# EasyEDA Pro project 8-Bit Breadboard Computer Schematics.eprj

# Schematic A-Regsiter
Create Date: 2025-08-08; Page Name: A-Regsiter; Project Name: 8-Bit Breadboard Computer Schematics; Schematic Name: A-Regsiter; Update Date: 2025-12-03; Company: EasyEDA.com; Page Size: A4; Version: V1.0
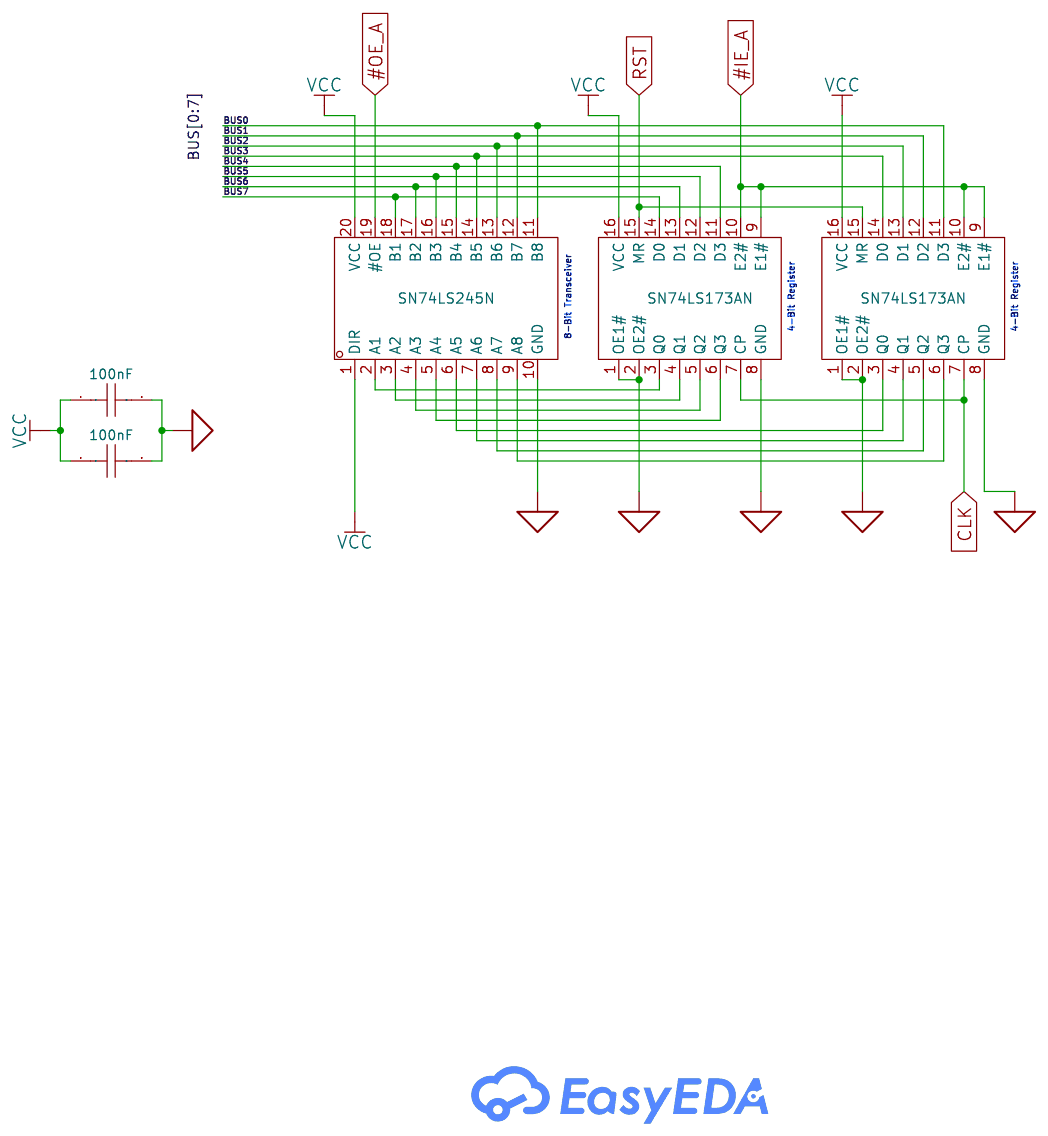
[diagram p0: schematic sheet]

## Parts
100nF  100nF Capacitor  [C0603]
100nF#2  100nF Capacitor  [C0603]
SN74LS173AN  74LS173 (4-Bit Register)  [PDIP-16_L19.3-W6.4-P2.54-LS7.94-BL]
SN74LS173AN#2  74LS173 (4-Bit Register)  [PDIP-16_L19.3-W6.4-P2.54-LS7.94-BL]
SN74LS245N  74LS245 (8-Bit Transceiver)  [DIP-20_L25.5-W10.0-P2.54-LS7.6-BL]

## Library data of the parts
100nF 100nF#2 = C0603C103K5RACTU KEMET Ceramic Capacitor: Supplier Part: C28056281; Supplier Footprint: 0603; Supplier: LCSC
SN74LS173AN = SN74LS173N(LX): LCSC Part Name: SN74LS173N; Supplier Part: C22466320; Manufacturer: LX(灵星芯微); Supplier Footprint: DIP-16; JLCPCB Part Class: Extended Part; Datasheet: https://atta.szlcsc.com/upload/public/pdf/source/20240614/F3FD9DFBB4BF77D77E15C2CBAE389656.pdf; Supplier: LCSC; Type: D-Type; Trigger Type: Rising Edge; Voltage - Supply: 2V~6V; Clock Frequency: 35MHz; Function: Reset; Number of Elements: 1; Number of Bits per Element: 4; Propagation Delay: 30ns@6V,50pF; Series: 74LS Series; Quiescent Current: 8uA; Operating Temperature: -40℃~+125℃
SN74LS173AN#2 = SN74LS173N(LX): LCSC Part Name: SN74LS173N; Supplier Part: C22466320; Manufacturer: LX(灵星芯微); Manufacturer Part: SN74LS173AN; Supplier Footprint: DIP-16; JLCPCB Part Class: Extended Part; Datasheet: https://atta.szlcsc.com/upload/public/pdf/source/20240614/F3FD9DFBB4BF77D77E15C2CBAE389656.pdf; Supplier: LCSC; Type: D-Type; Trigger Type: Rising Edge; Voltage - Supply: 2V~6V; Clock Frequency: 35MHz; Function: Reset; Number of Elements: 1; Number of Bits per Element: 4; Propagation Delay: 30ns@6V,50pF; Series: 74LS Series; Quiescent Current: 8uA; Operating Temperature: -40℃~+125℃
SN74LS245N = SN74LS245N: Supplier Part: C352966; Manufacturer: TI(德州仪器); Supplier Footprint: DIP-20; JLCPCB Part Class: Extended Part; Datasheet: https://www.ti.com/cn/lit/gpn/sn74ls245; Supplier: LCSC; output type: Tri-State; Voltage - Supply: 4.75V~5.25V; Number of Elements: 1; Number of Bits per Element: 8; Current - Output Low(IOL): 24mA; Current - Output High(IOH): 15mA; Logic Family: 74LS; Operating Temperature: 0℃~+70℃

## Nets
GND: 100nF.2 100nF#2.2 SN74LS173AN.1(OE1#) SN74LS173AN.2(OE2#) SN74LS173AN.8(GND) SN74LS173AN#2.1(OE1#) SN74LS173AN#2.2(OE2#) SN74LS173AN#2.8(GND) SN74LS245N.10(GND)
VCC: 100nF.1 100nF#2.1 SN74LS173AN.16(VCC) SN74LS173AN#2.16(VCC) SN74LS245N.1(DIR) SN74LS245N.20(VCC)
#IE_A: SN74LS173AN.9(E1#) SN74LS173AN.10(E2#) SN74LS173AN#2.9(E1#) SN74LS173AN#2.10(E2#)
#OE_A: SN74LS245N.19(#OE)
BUS0: SN74LS173AN#2.11(D3) SN74LS245N.11(B8)
BUS1: SN74LS173AN#2.12(D2) SN74LS245N.12(B7)
BUS2: SN74LS173AN#2.13(D1) SN74LS245N.13(B6)
BUS3: SN74LS173AN#2.14(D0) SN74LS245N.14(B5)
BUS4: SN74LS173AN.11(D3) SN74LS245N.15(B4)
BUS5: SN74LS173AN.12(D2) SN74LS245N.16(B3)
BUS6: SN74LS173AN.13(D1) SN74LS245N.17(B2)
BUS7: SN74LS173AN.14(D0) SN74LS245N.18(B1)
CLK: SN74LS173AN.7(CP) SN74LS173AN#2.7(CP)
RST: SN74LS173AN.15(MR) SN74LS173AN#2.15(MR)
Net-(SN74LS173AN#2-3): SN74LS173AN#2.3(Q0) SN74LS245N.6(A5)
Net-(SN74LS173AN#2-4): SN74LS173AN#2.4(Q1) SN74LS245N.7(A6)
Net-(SN74LS173AN#2-5): SN74LS173AN#2.5(Q2) SN74LS245N.8(A7)
Net-(SN74LS173AN#2-6): SN74LS173AN#2.6(Q3) SN74LS245N.9(A8)
Net-(SN74LS173AN-3): SN74LS173AN.3(Q0) SN74LS245N.2(A1)
Net-(SN74LS173AN-4): SN74LS173AN.4(Q1) SN74LS245N.3(A2)
Net-(SN74LS173AN-5): SN74LS173AN.5(Q2) SN74LS245N.4(A3)
Net-(SN74LS173AN-6): SN74LS173AN.6(Q3) SN74LS245N.5(A4)

## Notes on the sheet
- 8-Bit Transceiver
- 4-Bit Register
- 4-Bit Register

# Schematic B-Regsiter
Create Date: 2025-08-20; Page Name: B-Regsiter; Project Name: 8-Bit Breadboard Computer Schematics; Schematic Name: B-Regsiter; Update Date: 2025-12-23; Company: EasyEDA.com; Page Size: A4; Version: V1.0
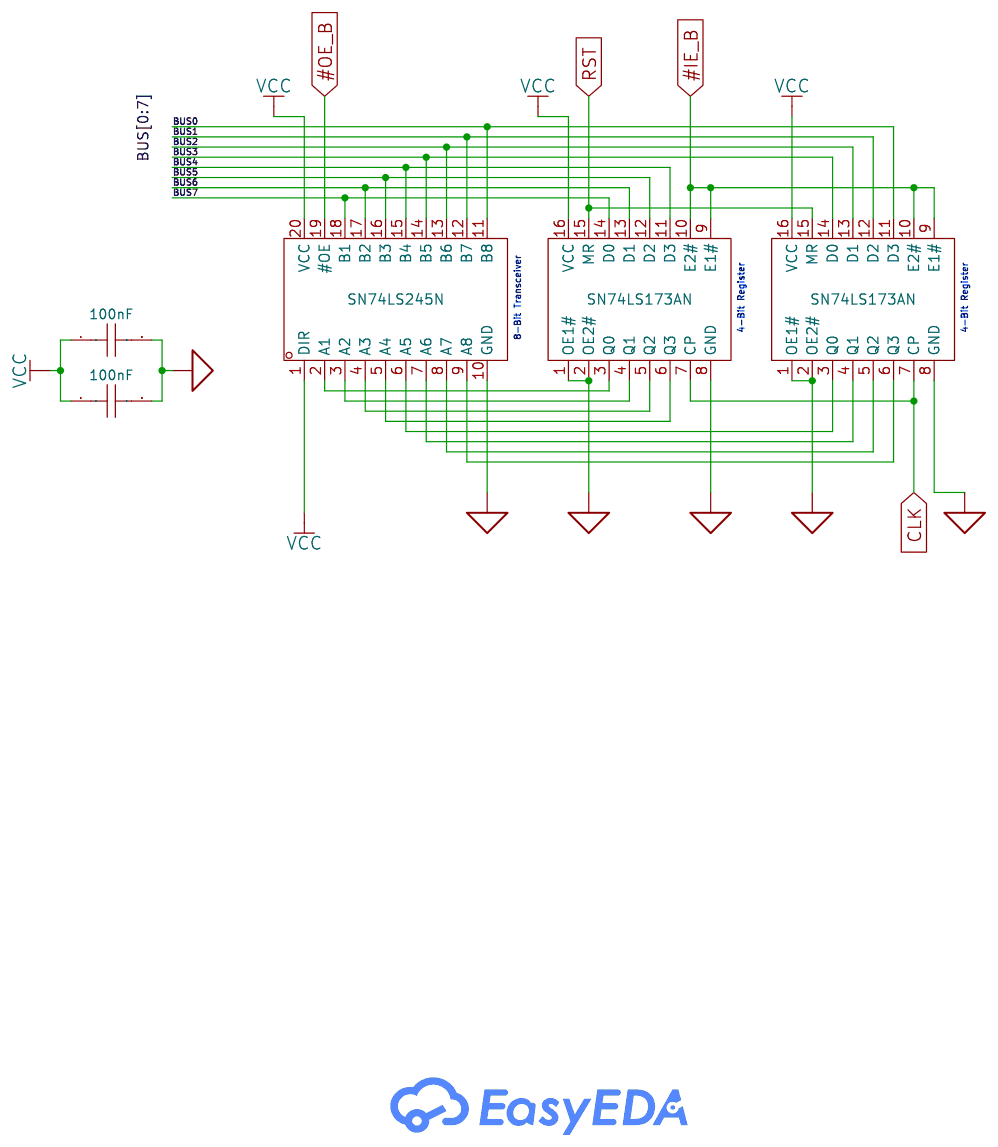
[diagram p1: schematic sheet]

## Parts
100nF  100nF Capacitor  [C0603]
100nF#2  100nF Capacitor  [C0603]
SN74LS173AN  74LS173 (4-Bit Register)  [PDIP-16_L19.3-W6.4-P2.54-LS7.94-BL]
SN74LS173AN#2  74LS173 (4-Bit Register)  [PDIP-16_L19.3-W6.4-P2.54-LS7.94-BL]
SN74LS245N  74LS245 (8-Bit Transceiver)  [DIP-20_L25.5-W10.0-P2.54-LS7.6-BL]

## Library data of the parts
100nF 100nF#2 = C0603C103K5RACTU KEMET Ceramic Capacitor: Supplier Part: C28056281; Supplier Footprint: 0603; Supplier: LCSC
SN74LS173AN = SN74LS173N(LX): LCSC Part Name: SN74LS173N; Supplier Part: C22466320; Manufacturer: LX(灵星芯微); Supplier Footprint: DIP-16; JLCPCB Part Class: Extended Part; Datasheet: https://atta.szlcsc.com/upload/public/pdf/source/20240614/F3FD9DFBB4BF77D77E15C2CBAE389656.pdf; Supplier: LCSC; Type: D-Type; Trigger Type: Rising Edge; Voltage - Supply: 2V~6V; Clock Frequency: 35MHz; Function: Reset; Number of Elements: 1; Number of Bits per Element: 4; Propagation Delay: 30ns@6V,50pF; Series: 74LS Series; Quiescent Current: 8uA; Operating Temperature: -40℃~+125℃
SN74LS173AN#2 = SN74LS173N(LX): LCSC Part Name: SN74LS173N; Supplier Part: C22466320; Manufacturer: LX(灵星芯微); Manufacturer Part: SN74LS173AN; Supplier Footprint: DIP-16; JLCPCB Part Class: Extended Part; Datasheet: https://atta.szlcsc.com/upload/public/pdf/source/20240614/F3FD9DFBB4BF77D77E15C2CBAE389656.pdf; Supplier: LCSC; Type: D-Type; Trigger Type: Rising Edge; Voltage - Supply: 2V~6V; Clock Frequency: 35MHz; Function: Reset; Number of Elements: 1; Number of Bits per Element: 4; Propagation Delay: 30ns@6V,50pF; Series: 74LS Series; Quiescent Current: 8uA; Operating Temperature: -40℃~+125℃
SN74LS245N = SN74LS245N: Supplier Part: C352966; Manufacturer: TI(德州仪器); Supplier Footprint: DIP-20; JLCPCB Part Class: Extended Part; Datasheet: https://www.ti.com/cn/lit/gpn/sn74ls245; Supplier: LCSC; output type: Tri-State; Voltage - Supply: 4.75V~5.25V; Number of Elements: 1; Number of Bits per Element: 8; Current - Output Low(IOL): 24mA; Current - Output High(IOH): 15mA; Logic Family: 74LS; Operating Temperature: 0℃~+70℃

## Nets
GND: 100nF.2 100nF#2.2 SN74LS173AN.1(OE1#) SN74LS173AN.2(OE2#) SN74LS173AN.8(GND) SN74LS173AN#2.1(OE1#) SN74LS173AN#2.2(OE2#) SN74LS173AN#2.8(GND) SN74LS245N.10(GND)
VCC: 100nF.1 100nF#2.1 SN74LS173AN.16(VCC) SN74LS173AN#2.16(VCC) SN74LS245N.1(DIR) SN74LS245N.20(VCC)
#IE_B: SN74LS173AN.9(E1#) SN74LS173AN.10(E2#) SN74LS173AN#2.9(E1#) SN74LS173AN#2.10(E2#)
#OE_B: SN74LS245N.19(#OE)
BUS0: SN74LS173AN#2.11(D3) SN74LS245N.11(B8)
BUS1: SN74LS173AN#2.12(D2) SN74LS245N.12(B7)
BUS2: SN74LS173AN#2.13(D1) SN74LS245N.13(B6)
BUS3: SN74LS173AN#2.14(D0) SN74LS245N.14(B5)
BUS4: SN74LS173AN.11(D3) SN74LS245N.15(B4)
BUS5: SN74LS173AN.12(D2) SN74LS245N.16(B3)
BUS6: SN74LS173AN.13(D1) SN74LS245N.17(B2)
BUS7: SN74LS173AN.14(D0) SN74LS245N.18(B1)
CLK: SN74LS173AN.7(CP) SN74LS173AN#2.7(CP)
RST: SN74LS173AN.15(MR) SN74LS173AN#2.15(MR)
Net-(SN74LS173AN#2-3): SN74LS173AN#2.3(Q0) SN74LS245N.6(A5)
Net-(SN74LS173AN#2-4): SN74LS173AN#2.4(Q1) SN74LS245N.7(A6)
Net-(SN74LS173AN#2-5): SN74LS173AN#2.5(Q2) SN74LS245N.8(A7)
Net-(SN74LS173AN#2-6): SN74LS173AN#2.6(Q3) SN74LS245N.9(A8)
Net-(SN74LS173AN-3): SN74LS173AN.3(Q0) SN74LS245N.2(A1)
Net-(SN74LS173AN-4): SN74LS173AN.4(Q1) SN74LS245N.3(A2)
Net-(SN74LS173AN-5): SN74LS173AN.5(Q2) SN74LS245N.4(A3)
Net-(SN74LS173AN-6): SN74LS173AN.6(Q3) SN74LS245N.5(A4)

## Notes on the sheet
- 8-Bit Transceiver
- 4-Bit Register
- 4-Bit Register

# Schematic TMP-Regsiter
Create Date: 2025-08-20; Page Name: TMP-Regsiter; Project Name: 8-Bit Breadboard Computer Schematics; Schematic Name: TMP-Regsiter; Update Date: 2025-12-23; Company: EasyEDA.com; Page Size: A4; Version: V1.0
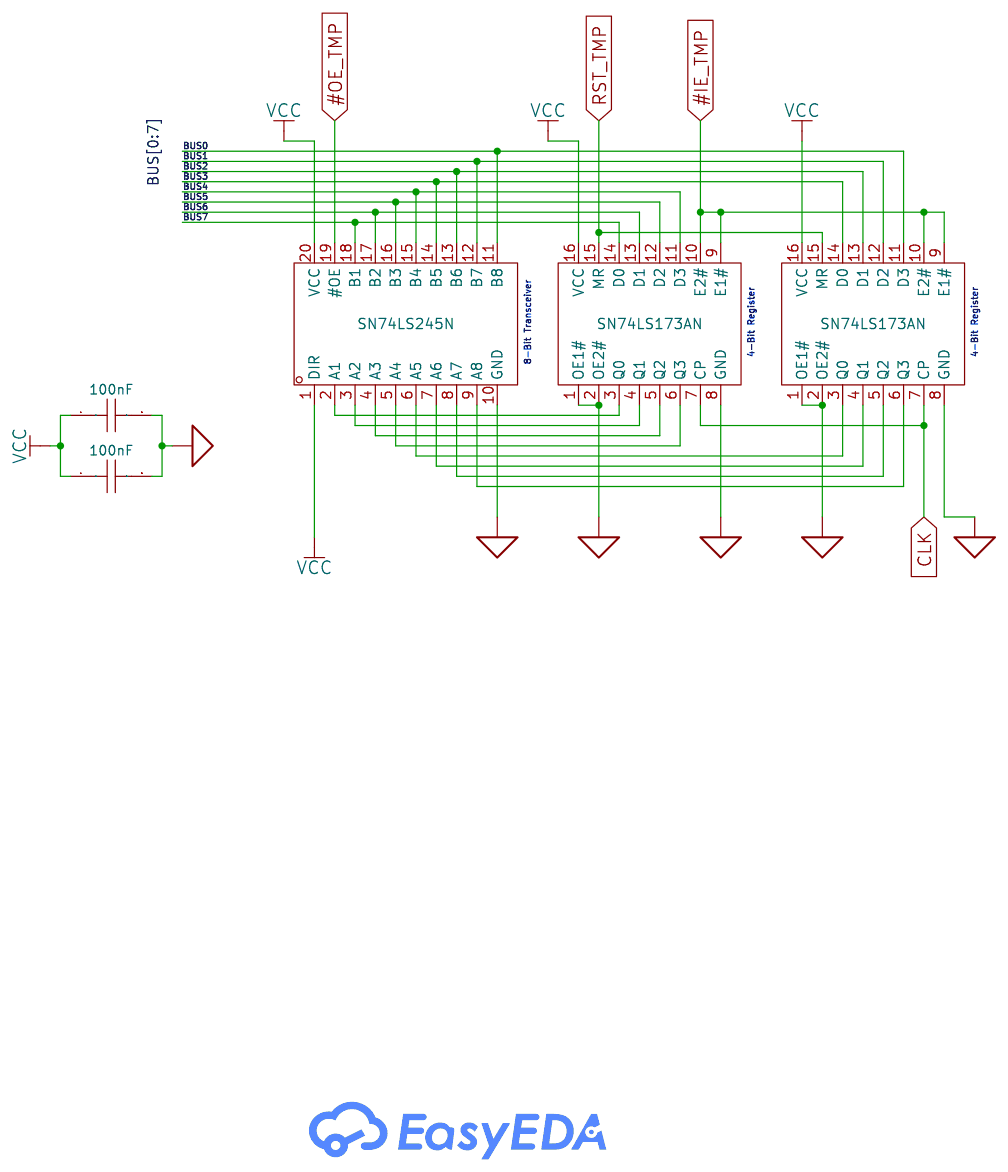
[diagram p2: schematic sheet]

## Parts
100nF  100nF Capacitor  [C0603]
100nF#2  100nF Capacitor  [C0603]
SN74LS173AN  74LS173 (4-Bit Register)  [PDIP-16_L19.3-W6.4-P2.54-LS7.94-BL]
SN74LS173AN#2  74LS173 (4-Bit Register)  [PDIP-16_L19.3-W6.4-P2.54-LS7.94-BL]
SN74LS245N  74LS245 (8-Bit Transceiver)  [DIP-20_L25.5-W10.0-P2.54-LS7.6-BL]

## Library data of the parts
100nF 100nF#2 = C0603C103K5RACTU KEMET Ceramic Capacitor: Supplier Part: C28056281; Supplier Footprint: 0603; Supplier: LCSC
SN74LS173AN = SN74LS173N(LX): LCSC Part Name: SN74LS173N; Supplier Part: C22466320; Manufacturer: LX(灵星芯微); Supplier Footprint: DIP-16; JLCPCB Part Class: Extended Part; Datasheet: https://atta.szlcsc.com/upload/public/pdf/source/20240614/F3FD9DFBB4BF77D77E15C2CBAE389656.pdf; Supplier: LCSC; Type: D-Type; Trigger Type: Rising Edge; Voltage - Supply: 2V~6V; Clock Frequency: 35MHz; Function: Reset; Number of Elements: 1; Number of Bits per Element: 4; Propagation Delay: 30ns@6V,50pF; Series: 74LS Series; Quiescent Current: 8uA; Operating Temperature: -40℃~+125℃
SN74LS173AN#2 = SN74LS173N(LX): LCSC Part Name: SN74LS173N; Supplier Part: C22466320; Manufacturer: LX(灵星芯微); Manufacturer Part: SN74LS173AN; Supplier Footprint: DIP-16; JLCPCB Part Class: Extended Part; Datasheet: https://atta.szlcsc.com/upload/public/pdf/source/20240614/F3FD9DFBB4BF77D77E15C2CBAE389656.pdf; Supplier: LCSC; Type: D-Type; Trigger Type: Rising Edge; Voltage - Supply: 2V~6V; Clock Frequency: 35MHz; Function: Reset; Number of Elements: 1; Number of Bits per Element: 4; Propagation Delay: 30ns@6V,50pF; Series: 74LS Series; Quiescent Current: 8uA; Operating Temperature: -40℃~+125℃
SN74LS245N = SN74LS245N: Supplier Part: C352966; Manufacturer: TI(德州仪器); Supplier Footprint: DIP-20; JLCPCB Part Class: Extended Part; Datasheet: https://www.ti.com/cn/lit/gpn/sn74ls245; Supplier: LCSC; output type: Tri-State; Voltage - Supply: 4.75V~5.25V; Number of Elements: 1; Number of Bits per Element: 8; Current - Output Low(IOL): 24mA; Current - Output High(IOH): 15mA; Logic Family: 74LS; Operating Temperature: 0℃~+70℃

## Nets
GND: 100nF.2 100nF#2.2 SN74LS173AN.1(OE1#) SN74LS173AN.2(OE2#) SN74LS173AN.8(GND) SN74LS173AN#2.1(OE1#) SN74LS173AN#2.2(OE2#) SN74LS173AN#2.8(GND) SN74LS245N.10(GND)
VCC: 100nF.1 100nF#2.1 SN74LS173AN.16(VCC) SN74LS173AN#2.16(VCC) SN74LS245N.1(DIR) SN74LS245N.20(VCC)
#IE_TMP: SN74LS173AN.9(E1#) SN74LS173AN.10(E2#) SN74LS173AN#2.9(E1#) SN74LS173AN#2.10(E2#)
#OE_TMP: SN74LS245N.19(#OE)
BUS0: SN74LS173AN#2.11(D3) SN74LS245N.11(B8)
BUS1: SN74LS173AN#2.12(D2) SN74LS245N.12(B7)
BUS2: SN74LS173AN#2.13(D1) SN74LS245N.13(B6)
BUS3: SN74LS173AN#2.14(D0) SN74LS245N.14(B5)
BUS4: SN74LS173AN.11(D3) SN74LS245N.15(B4)
BUS5: SN74LS173AN.12(D2) SN74LS245N.16(B3)
BUS6: SN74LS173AN.13(D1) SN74LS245N.17(B2)
BUS7: SN74LS173AN.14(D0) SN74LS245N.18(B1)
CLK: SN74LS173AN.7(CP) SN74LS173AN#2.7(CP)
RST_TMP: SN74LS173AN.15(MR) SN74LS173AN#2.15(MR)
Net-(SN74LS173AN#2-3): SN74LS173AN#2.3(Q0) SN74LS245N.6(A5)
Net-(SN74LS173AN#2-4): SN74LS173AN#2.4(Q1) SN74LS245N.7(A6)
Net-(SN74LS173AN#2-5): SN74LS173AN#2.5(Q2) SN74LS245N.8(A7)
Net-(SN74LS173AN#2-6): SN74LS173AN#2.6(Q3) SN74LS245N.9(A8)
Net-(SN74LS173AN-3): SN74LS173AN.3(Q0) SN74LS245N.2(A1)
Net-(SN74LS173AN-4): SN74LS173AN.4(Q1) SN74LS245N.3(A2)
Net-(SN74LS173AN-5): SN74LS173AN.5(Q2) SN74LS245N.4(A3)
Net-(SN74LS173AN-6): SN74LS173AN.6(Q3) SN74LS245N.5(A4)

## Notes on the sheet
- 8-Bit Transceiver
- 4-Bit Register
- 4-Bit Register

# Schematic Flags-Register
Create Date: 2025-08-30; Page Name: Flags-Register; Project Name: 8-Bit Breadboard Computer Schematics; Schematic Name: Flags-Register; Update Date: 2025-11-29; Company: EasyEDA.com; Page Size: A4; Version: V1.0
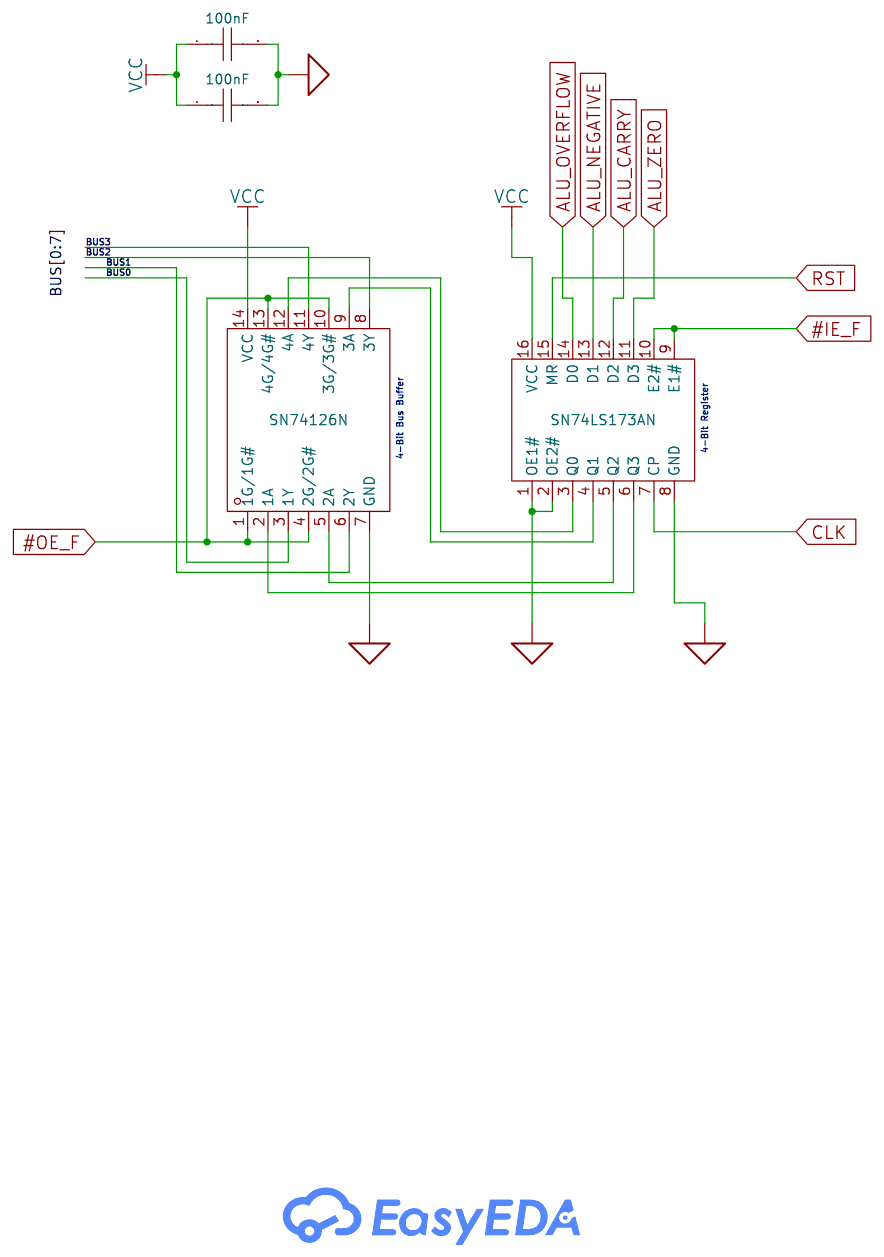
[diagram p3: schematic sheet]

## Parts
100nF  100nF Capacitor  [C0603]
100nF#2  100nF Capacitor  [C0603]
SN74LS173AN  74LS173 (4-Bit Register)  [PDIP-16_L19.3-W6.4-P2.54-LS7.94-BL]
SN74126N  74126 (4-Bit Bus Buffer)  [PDIP-14_L19.3-W6.4-P2.54-LS7.9-BL-1]

## Library data of the parts
100nF 100nF#2 = C0603C103K5RACTU KEMET Ceramic Capacitor: Supplier Part: C28056281; Supplier Footprint: 0603; Supplier: LCSC
SN74LS173AN = SN74LS173N(LX): LCSC Part Name: SN74LS173N; Supplier Part: C22466320; Manufacturer: LX(灵星芯微); Supplier Footprint: DIP-16; JLCPCB Part Class: Extended Part; Datasheet: https://atta.szlcsc.com/upload/public/pdf/source/20240614/F3FD9DFBB4BF77D77E15C2CBAE389656.pdf; Supplier: LCSC; Type: D-Type; Trigger Type: Rising Edge; Voltage - Supply: 2V~6V; Clock Frequency: 35MHz; Function: Reset; Number of Elements: 1; Number of Bits per Element: 4; Propagation Delay: 30ns@6V,50pF; Series: 74LS Series; Quiescent Current: 8uA; Operating Temperature: -40℃~+125℃
SN74126N = SN74126N: Supplier Part: C3755543; Manufacturer: TI(德州仪器); JLCPCB Part Class: Extended Part; Datasheet: https://atta.szlcsc.com/upload/public/pdf/source/20230921/D1683B70E3503115BE8957D2000F591F.pdf; Supplier: LCSC

## Nets
GND: 100nF.2 100nF#2.2 SN74LS173AN.1(OE1#) SN74LS173AN.2(OE2#) SN74LS173AN.8(GND) SN74126N.7(GND)
VCC: 100nF.1 100nF#2.1 SN74LS173AN.16(VCC) SN74126N.14(VCC)
#IE_F: SN74LS173AN.9(E1#) SN74LS173AN.10(E2#)
#OE_F: SN74126N.1(1G/1G#) SN74126N.4(2G/2G#) SN74126N.10(3G/3G#) SN74126N.13(4G/4G#)
ALU_CARRY: SN74LS173AN.12(D2)
ALU_NEGATIVE: SN74LS173AN.13(D1)
ALU_OVERFLOW: SN74LS173AN.14(D0)
ALU_ZERO: SN74LS173AN.11(D3)
BUS0: SN74126N.3(1Y)
BUS1: SN74126N.6(2Y)
BUS2: SN74126N.8(3Y)
BUS3: SN74126N.11(4Y)
CLK: SN74LS173AN.7(CP)
RST: SN74LS173AN.15(MR)
Net-(SN74LS173AN-3): SN74LS173AN.3(Q0) SN74126N.12(4A)
Net-(SN74LS173AN-4): SN74LS173AN.4(Q1) SN74126N.9(3A)
Net-(SN74LS173AN-5): SN74LS173AN.5(Q2) SN74126N.5(2A)
Net-(SN74LS173AN-6): SN74LS173AN.6(Q3) SN74126N.2(1A)

## Notes on the sheet
- 4-Bit Bus Buffer
- 4-Bit Register

# Schematic Buffer-Register
Create Date: 2025-09-07; Page Name: Buffer-Register; Project Name: 8-Bit Breadboard Computer Schematics; Schematic Name: Buffer-Register; Update Date: 2025-12-03; Company: EasyEDA.com; Page Size: A4; Version: V1.0
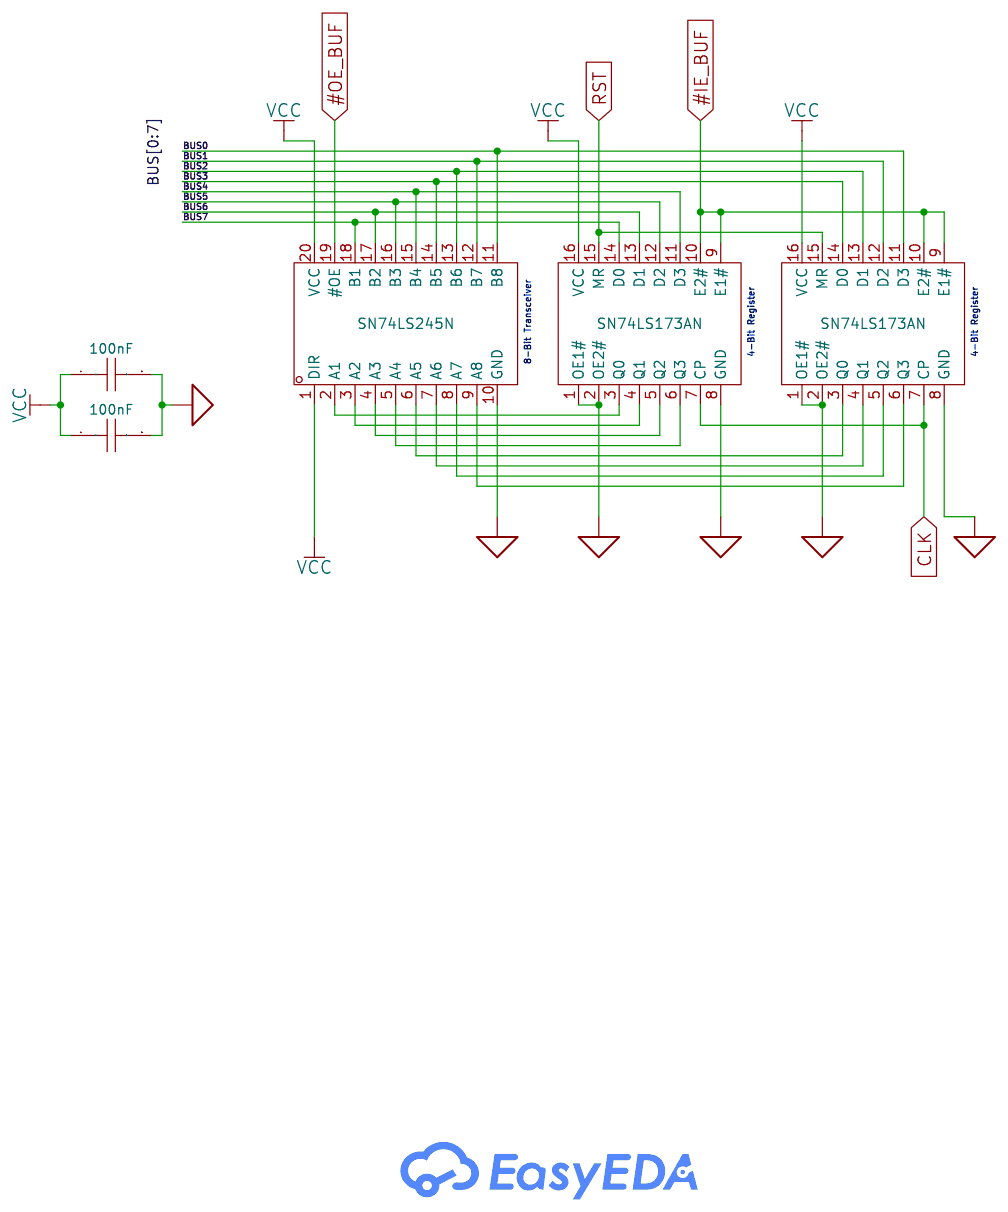
[diagram p4: schematic sheet]

## Parts
100nF  100nF Capacitor  [C0603]
100nF#2  100nF Capacitor  [C0603]
SN74LS173AN  74LS173 (4-Bit Register)  [PDIP-16_L19.3-W6.4-P2.54-LS7.94-BL]
SN74LS173AN#2  74LS173 (4-Bit Register)  [PDIP-16_L19.3-W6.4-P2.54-LS7.94-BL]
SN74LS245N  74LS245 (8-Bit Transceiver)  [DIP-20_L25.5-W10.0-P2.54-LS7.6-BL]

## Library data of the parts
100nF 100nF#2 = C0603C103K5RACTU KEMET Ceramic Capacitor: Supplier Part: C28056281; Supplier Footprint: 0603; Supplier: LCSC
SN74LS173AN = SN74LS173N(LX): LCSC Part Name: SN74LS173N; Supplier Part: C22466320; Manufacturer: LX(灵星芯微); Supplier Footprint: DIP-16; JLCPCB Part Class: Extended Part; Datasheet: https://atta.szlcsc.com/upload/public/pdf/source/20240614/F3FD9DFBB4BF77D77E15C2CBAE389656.pdf; Supplier: LCSC; Type: D-Type; Trigger Type: Rising Edge; Voltage - Supply: 2V~6V; Clock Frequency: 35MHz; Function: Reset; Number of Elements: 1; Number of Bits per Element: 4; Propagation Delay: 30ns@6V,50pF; Series: 74LS Series; Quiescent Current: 8uA; Operating Temperature: -40℃~+125℃
SN74LS173AN#2 = SN74LS173N(LX): LCSC Part Name: SN74LS173N; Supplier Part: C22466320; Manufacturer: LX(灵星芯微); Manufacturer Part: SN74LS173AN; Supplier Footprint: DIP-16; JLCPCB Part Class: Extended Part; Datasheet: https://atta.szlcsc.com/upload/public/pdf/source/20240614/F3FD9DFBB4BF77D77E15C2CBAE389656.pdf; Supplier: LCSC; Type: D-Type; Trigger Type: Rising Edge; Voltage - Supply: 2V~6V; Clock Frequency: 35MHz; Function: Reset; Number of Elements: 1; Number of Bits per Element: 4; Propagation Delay: 30ns@6V,50pF; Series: 74LS Series; Quiescent Current: 8uA; Operating Temperature: -40℃~+125℃
SN74LS245N = SN74LS245N: Supplier Part: C352966; Manufacturer: TI(德州仪器); Supplier Footprint: DIP-20; JLCPCB Part Class: Extended Part; Datasheet: https://www.ti.com/cn/lit/gpn/sn74ls245; Supplier: LCSC; output type: Tri-State; Voltage - Supply: 4.75V~5.25V; Number of Elements: 1; Number of Bits per Element: 8; Current - Output Low(IOL): 24mA; Current - Output High(IOH): 15mA; Logic Family: 74LS; Operating Temperature: 0℃~+70℃

## Nets
GND: 100nF.2 100nF#2.2 SN74LS173AN.1(OE1#) SN74LS173AN.2(OE2#) SN74LS173AN.8(GND) SN74LS173AN#2.1(OE1#) SN74LS173AN#2.2(OE2#) SN74LS173AN#2.8(GND) SN74LS245N.10(GND)
VCC: 100nF.1 100nF#2.1 SN74LS173AN.16(VCC) SN74LS173AN#2.16(VCC) SN74LS245N.1(DIR) SN74LS245N.20(VCC)
#IE_BUF: SN74LS173AN.9(E1#) SN74LS173AN.10(E2#) SN74LS173AN#2.9(E1#) SN74LS173AN#2.10(E2#)
#OE_BUF: SN74LS245N.19(#OE)
BUS0: SN74LS173AN#2.11(D3) SN74LS245N.11(B8)
BUS1: SN74LS173AN#2.12(D2) SN74LS245N.12(B7)
BUS2: SN74LS173AN#2.13(D1) SN74LS245N.13(B6)
BUS3: SN74LS173AN#2.14(D0) SN74LS245N.14(B5)
BUS4: SN74LS173AN.11(D3) SN74LS245N.15(B4)
BUS5: SN74LS173AN.12(D2) SN74LS245N.16(B3)
BUS6: SN74LS173AN.13(D1) SN74LS245N.17(B2)
BUS7: SN74LS173AN.14(D0) SN74LS245N.18(B1)
CLK: SN74LS173AN.7(CP) SN74LS173AN#2.7(CP)
RST: SN74LS173AN.15(MR) SN74LS173AN#2.15(MR)
Net-(SN74LS173AN#2-3): SN74LS173AN#2.3(Q0) SN74LS245N.6(A5)
Net-(SN74LS173AN#2-4): SN74LS173AN#2.4(Q1) SN74LS245N.7(A6)
Net-(SN74LS173AN#2-5): SN74LS173AN#2.5(Q2) SN74LS245N.8(A7)
Net-(SN74LS173AN#2-6): SN74LS173AN#2.6(Q3) SN74LS245N.9(A8)
Net-(SN74LS173AN-3): SN74LS173AN.3(Q0) SN74LS245N.2(A1)
Net-(SN74LS173AN-4): SN74LS173AN.4(Q1) SN74LS245N.3(A2)
Net-(SN74LS173AN-5): SN74LS173AN.5(Q2) SN74LS245N.4(A3)
Net-(SN74LS173AN-6): SN74LS173AN.6(Q3) SN74LS245N.5(A4)

## Notes on the sheet
- 8-Bit Transceiver
- 4-Bit Register
- 4-Bit Register

# Schematic IR
Create Date: 2025-09-07; Page Name: Instruction Register; Project Name: 8-Bit Breadboard Computer Schematics; Schematic Name: IR; Update Date: 2025-12-03; Company: EasyEDA.com; Page Size: A4; Version: V1.0
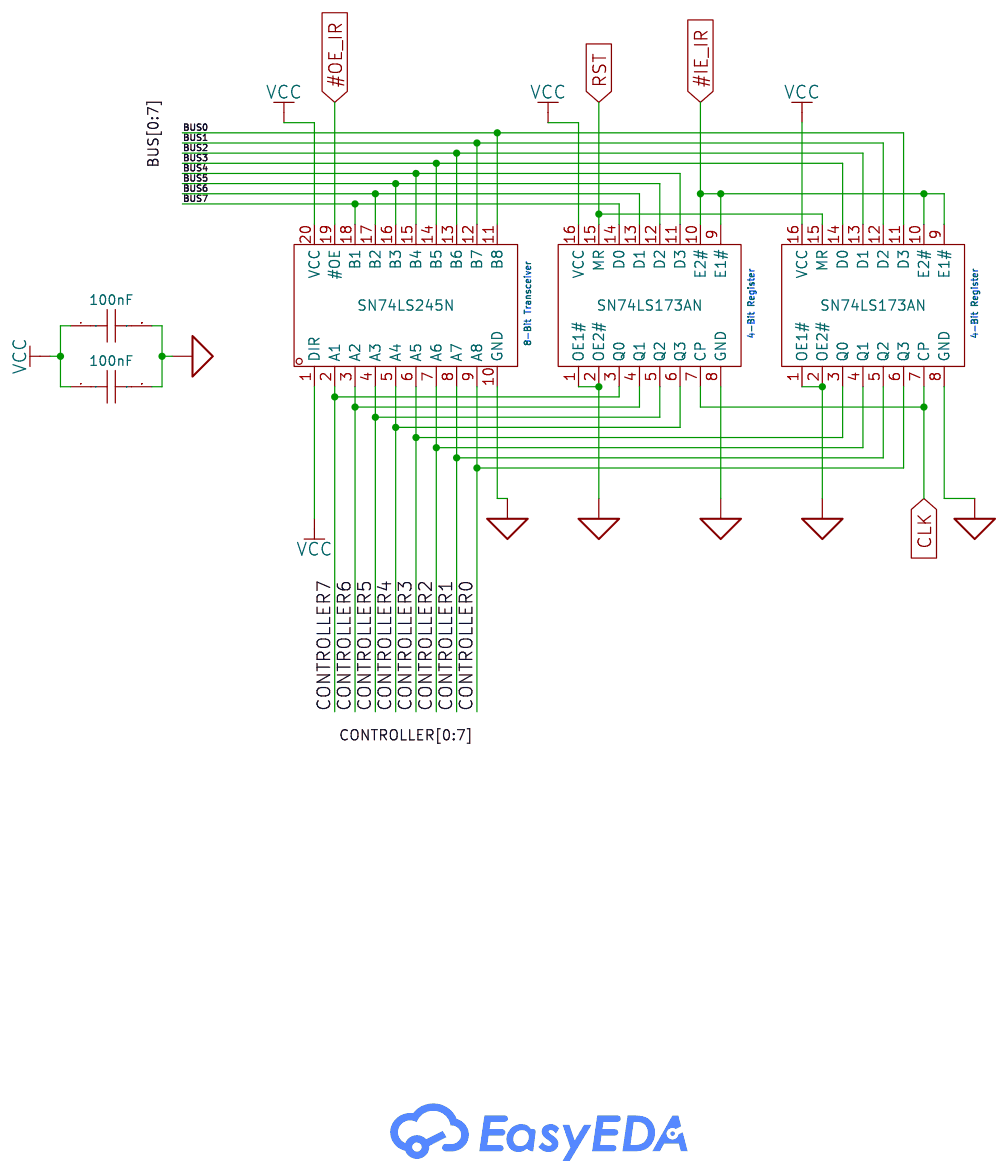
[diagram p5: schematic sheet]

## Parts
100nF  100nF Capacitor  [C0603]
100nF#2  100nF Capacitor  [C0603]
SN74LS173AN  74LS173 (4-Bit Register)  [PDIP-16_L19.3-W6.4-P2.54-LS7.94-BL]
SN74LS173AN#2  74LS173 (4-Bit Register)  [PDIP-16_L19.3-W6.4-P2.54-LS7.94-BL]
SN74LS245N  74LS245 (8-Bit Transceiver)  [DIP-20_L25.5-W10.0-P2.54-LS7.6-BL]

## Library data of the parts
100nF 100nF#2 = C0603C103K5RACTU KEMET Ceramic Capacitor: Supplier Part: C28056281; Supplier Footprint: 0603; Supplier: LCSC
SN74LS173AN = SN74LS173N(LX): LCSC Part Name: SN74LS173N; Supplier Part: C22466320; Manufacturer: LX(灵星芯微); Supplier Footprint: DIP-16; JLCPCB Part Class: Extended Part; Datasheet: https://atta.szlcsc.com/upload/public/pdf/source/20240614/F3FD9DFBB4BF77D77E15C2CBAE389656.pdf; Supplier: LCSC; Type: D-Type; Trigger Type: Rising Edge; Voltage - Supply: 2V~6V; Clock Frequency: 35MHz; Function: Reset; Number of Elements: 1; Number of Bits per Element: 4; Propagation Delay: 30ns@6V,50pF; Series: 74LS Series; Quiescent Current: 8uA; Operating Temperature: -40℃~+125℃
SN74LS173AN#2 = SN74LS173N(LX): LCSC Part Name: SN74LS173N; Supplier Part: C22466320; Manufacturer: LX(灵星芯微); Manufacturer Part: SN74LS173AN; Supplier Footprint: DIP-16; JLCPCB Part Class: Extended Part; Datasheet: https://atta.szlcsc.com/upload/public/pdf/source/20240614/F3FD9DFBB4BF77D77E15C2CBAE389656.pdf; Supplier: LCSC; Type: D-Type; Trigger Type: Rising Edge; Voltage - Supply: 2V~6V; Clock Frequency: 35MHz; Function: Reset; Number of Elements: 1; Number of Bits per Element: 4; Propagation Delay: 30ns@6V,50pF; Series: 74LS Series; Quiescent Current: 8uA; Operating Temperature: -40℃~+125℃
SN74LS245N = SN74LS245N: Supplier Part: C352966; Manufacturer: TI(德州仪器); Supplier Footprint: DIP-20; JLCPCB Part Class: Extended Part; Datasheet: https://www.ti.com/cn/lit/gpn/sn74ls245; Supplier: LCSC; output type: Tri-State; Voltage - Supply: 4.75V~5.25V; Number of Elements: 1; Number of Bits per Element: 8; Current - Output Low(IOL): 24mA; Current - Output High(IOH): 15mA; Logic Family: 74LS; Operating Temperature: 0℃~+70℃

## Nets
GND: 100nF.2 100nF#2.2 SN74LS173AN.1(OE1#) SN74LS173AN.2(OE2#) SN74LS173AN.8(GND) SN74LS173AN#2.1(OE1#) SN74LS173AN#2.2(OE2#) SN74LS173AN#2.8(GND) SN74LS245N.10(GND)
VCC: 100nF.1 100nF#2.1 SN74LS173AN.16(VCC) SN74LS173AN#2.16(VCC) SN74LS245N.1(DIR) SN74LS245N.20(VCC)
#IE_IR: SN74LS173AN.9(E1#) SN74LS173AN.10(E2#) SN74LS173AN#2.9(E1#) SN74LS173AN#2.10(E2#)
#OE_IR: SN74LS245N.19(#OE)
BUS0: SN74LS173AN#2.11(D3) SN74LS245N.11(B8)
BUS1: SN74LS173AN#2.12(D2) SN74LS245N.12(B7)
BUS2: SN74LS173AN#2.13(D1) SN74LS245N.13(B6)
BUS3: SN74LS173AN#2.14(D0) SN74LS245N.14(B5)
BUS4: SN74LS173AN.11(D3) SN74LS245N.15(B4)
BUS5: SN74LS173AN.12(D2) SN74LS245N.16(B3)
BUS6: SN74LS173AN.13(D1) SN74LS245N.17(B2)
BUS7: SN74LS173AN.14(D0) SN74LS245N.18(B1)
CLK: SN74LS173AN.7(CP) SN74LS173AN#2.7(CP)
CONTROLLER0: SN74LS173AN#2.6(Q3) SN74LS245N.9(A8)
CONTROLLER1: SN74LS173AN#2.5(Q2) SN74LS245N.8(A7)
CONTROLLER2: SN74LS173AN#2.4(Q1) SN74LS245N.7(A6)
CONTROLLER3: SN74LS173AN#2.3(Q0) SN74LS245N.6(A5)
CONTROLLER4: SN74LS173AN.6(Q3) SN74LS245N.5(A4)
CONTROLLER5: SN74LS173AN.5(Q2) SN74LS245N.4(A3)
CONTROLLER6: SN74LS173AN.4(Q1) SN74LS245N.3(A2)
CONTROLLER7: SN74LS173AN.3(Q0) SN74LS245N.2(A1)
RST: SN74LS173AN.15(MR) SN74LS173AN#2.15(MR)

## Notes on the sheet
- 8-Bit Transceiver
- 4-Bit Register
- 4-Bit Register
